# EAGLE design vgnd (EAGLE 6.5.0)
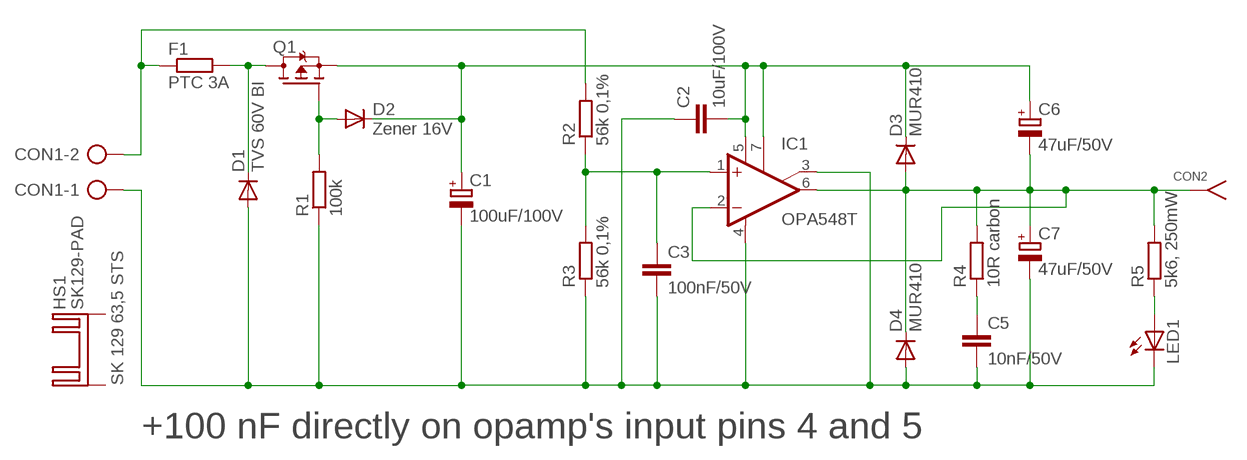
[diagram p0: schematic, sheet 1]

## Parts
C1  100uF/100V  CPOL-EUE5-10.5  [E5-10,5]
C2  10uF/100V  C-EUC2220K  [C2220K]
C3  100nF/50V  C-EUC0603  [C0603]
C5  10nF/50V  C-EUC0603  [C0603]
C6  47uF/50V  CPOL-EUE2.5-7  [E2,5-7]
C7  47uF/50V  CPOL-EUE2.5-7  [E2,5-7]
CON1  AK500/2  [AK500/2]
CON2  FCR7350  [BANANA-PCB-S16N]
D1  TVS 60V BI  DIODE-SMC  [SMC]
D2  Zener 16V  DIODE-SOD323-R  [SOD323-R]
D3  MUR410  DIODE-DO201-15  [DO201-15]
D4  MUR410  DIODE-DO201-15  [DO201-15]
F1  PTC 3A  R-EU_0309/10  [0309/10]
HS1  SK129-PAD  [SK129]
IC1  OPA548T  [TO220-7]
LED1  LEDCHIPLED_0603  [CHIPLED_0603]
Q1  FDD4141TO252  [TO252]
R1  100k  R-EU_R0603  [R0603]
R2  56k 0,1%  R-EU_R0603  [R0603]
R3  56k 0,1%  R-EU_R0603  [R0603]
R4  10R carbon  R-EU_0207/10  [0207/10]
R5  5k6, 250mW  R-EU_M1206  [M1206]

## Nets
GND: C6.- C7.+ CON2.P$1(CON$1) CON2.P$2(CON$1) CON2.P$3(CON$1) CON2.P$4(CON$1) CON2.P$5(CON$1) D3.A D4.C IC1.2(-IN) IC1.6(OUT) R4.2 R5.2
N$1: D1.C F1.2 Q1.3(D)
N$2: C3.1 IC1.1(+IN) R2.1 R3.2
N$3: D2.A Q1.1(G) R1.2
N$4: LED1.A R5.1
N$5: C5.1 R4.1
N$6: CON1.2 F1.1 R2.2
NEG: C1.- C2.1 C3.2 C5.2 C7.- CON1.1 D1.A D4.A IC1.3(ILIM) IC1.4(V-) LED1.C R1.1 R3.1
POS: C1.+ C2.2 C6.+ D2.C D3.C IC1.5(V+) IC1.7(E/S) Q1.2(S)
Unconnected: HS1.A2,5(K) HS1.B2,5(K)

## Notes on the sheet
- +100 nF directly on opamp's input pins 4 and 5

## Library data of the parts
C1 C6 C7 = rcl:CPOL-EU: POLARIZED CAPACITOR, European symbol
C2 C3 C5 = rcl:C-EU: CAPACITOR, European symbol
CON1 = con-ptr500:AK500/2: CONNECTOR; OC_FARNELL: unknown; OC_NEWARK: unknown
CON2 = kaktus:FCR7350: Cliff electronic PCB 4 mm banana socket FCR7350
D1-D4 = diode:DIODE-: DIODE
F1 R5 = rcl:R-EU_: RESISTOR, European symbol
HS1 = heatsink:SK129-PAD: HEATSINK manufacturer Fischer/distributor Buerklin; ITEM: SK 129 63,5 STS
IC1 = burr-brown:OPA548: Operational Amplifier High-Voltage, High-Current; MF: TEXAS INSTRUMENTS; MPN: OPA548T; OC_FARNELL: 1564885; OC_NEWARK: 69K2680
LED1 = adafruit:LED: LED OSRAM: - CHIPLED LG R971, LG N971, LY N971, LG Q971, LY Q971, LO R971, LY R971 LH N974, LH R974 LS Q976, LO Q976, LY Q976 LO Q996 - Hyper CHIPLED LW Q18S LB Q993, LB Q99A, LB R99A - SideLED LS A670, LO A670, LY A670, LG A670, LP A670 LB A673, LV A673, LT A673, LW A673 LH A674 LY A675 LS A676, LA A676, LO A676, LY A676, LW A676 LS A679, LY A679, LG A679 - Hyper Micro SIDELED® LS Y876, LA Y876, LO Y876, LY Y876 LT Y87S - SmartLED LW L88C, LW L88S LB L89C, LB L89S, LG L890 LS L89K, LO L89K, LY L89K LS L896, LA L896, LO L896, LY L896 - TOPLED LS T670, LO T670, LY T670, LG T670, LP T670 LSG T670, LSP T670, LSY T670, LOP T670, LYG T670 LG T671, LOG T671, LSG T671 LB T673, LV T673, LT T673, LW T673 LH T674 LS T676, LA T676, LO T676, LY T676, LB T676, LH T676, LSB T676, LW T676 LB T67C, LV T67C, LT T67C, LS T67K, LO T67K, LY T67K, LW E67C LS E67B, LA E67B, LO E67B, LY E67B, LB E67C, LV E67C, LT E67C LW T67C LS T679, LY T679, LG T679 LS T770, LO T770, LY T770, LG T770, LP T770 LB T773, LV T773, LT T773, LW T773 LH T774 LS E675, LA E675, LY E675, LS T675 LS T776, LA T776, LO T776, LY T776, LB T776 LHGB T686 LT T68C, LB T68C - Hyper Mini TOPLED® LB M676 - Mini TOPLED Santana® LG M470 LS M47K, LO M47K, LY M47K Source: http://www.osram.convergy.de/
Q1 = transistor-fet:FDD4141: P-Channel PowerTrench® MOSFET Source: FDD4141.pdf
R1-R4 = resistor:R-EU_: RESISTOR, European symbol

## Board
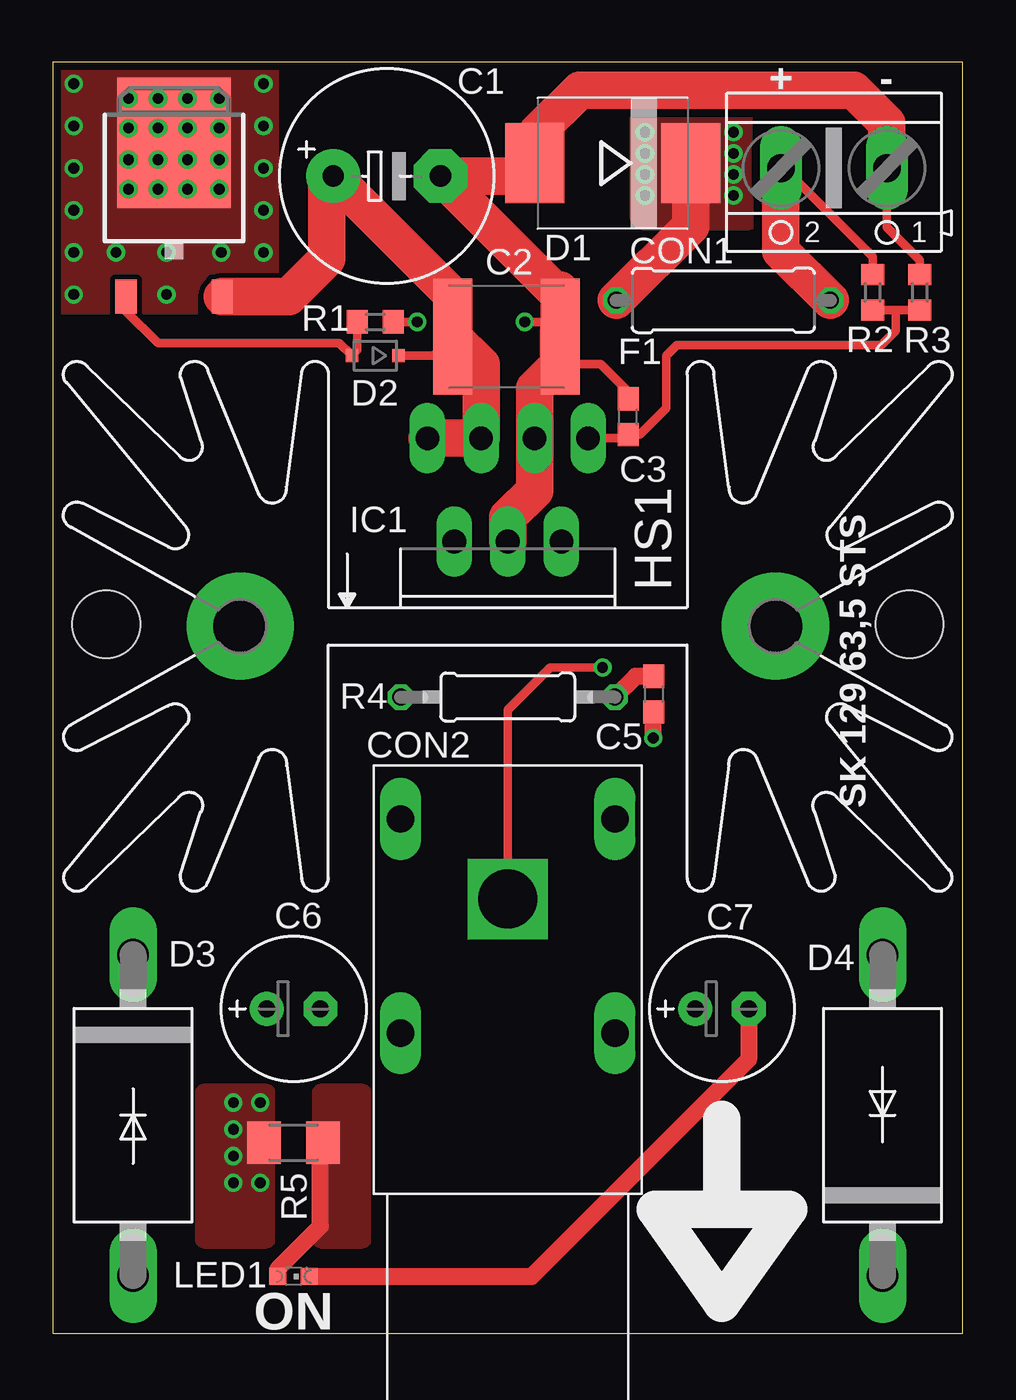
[diagram p1: board, top side]
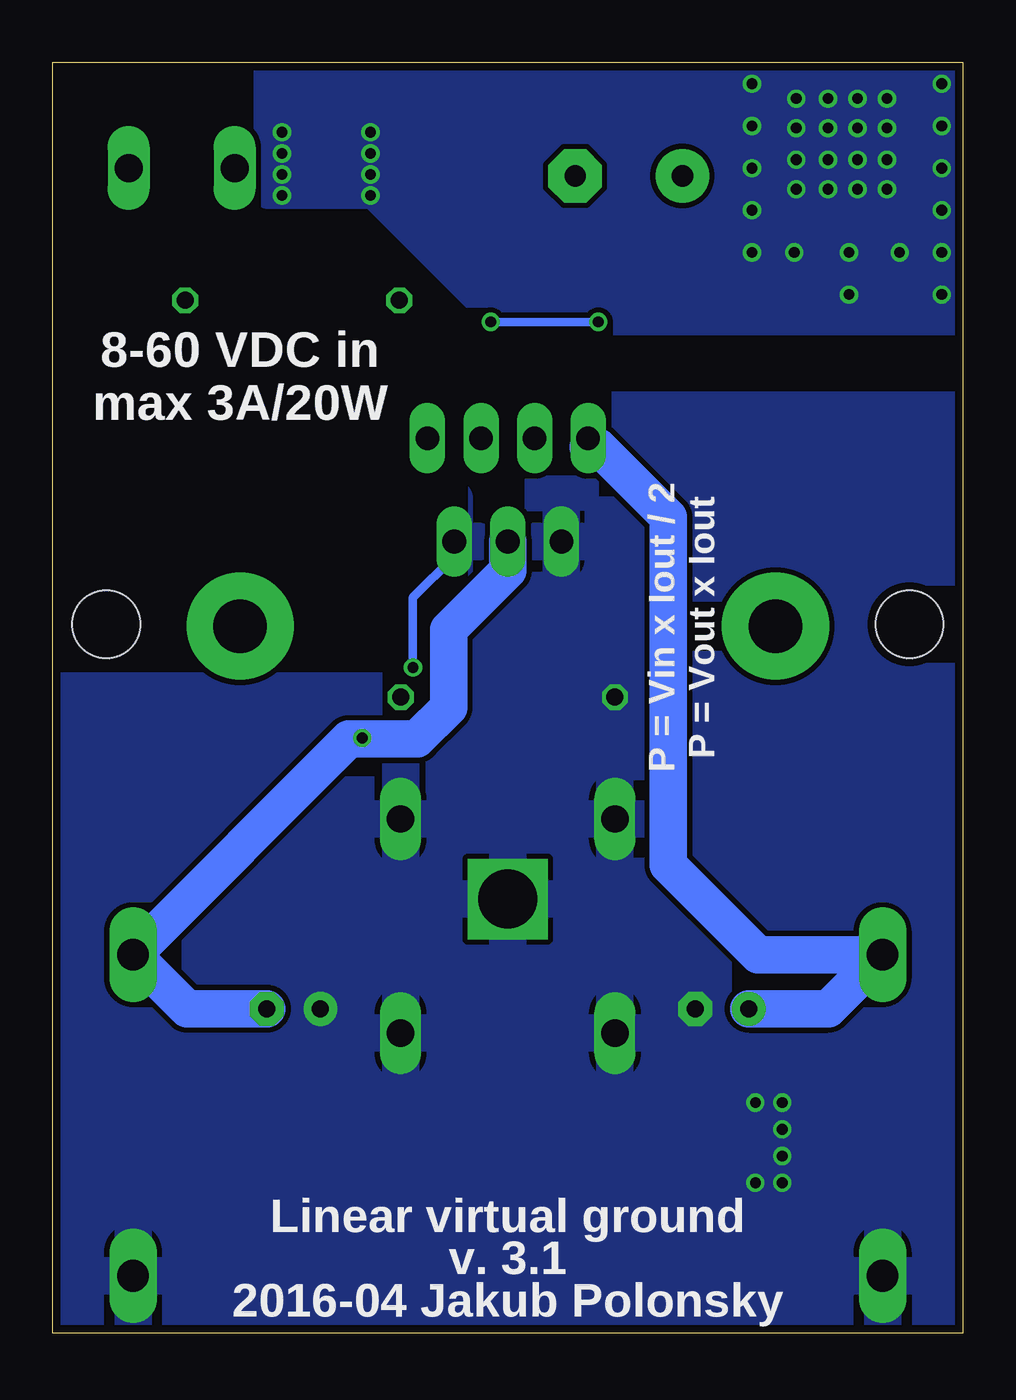
[diagram p2: board, bottom side, seen from below]

Size 43.18 x 60.33 mm. Coordinates in mm from the lower left corner, seen from the top.
Outline: 0,0 43.18,0 43.18,60.33 0,60.33 0,0
Copper layers (1*16): Top 0.0356mm / dielectric 1.5011mm / Bottom 0.0356mm
Design rules "OSHPark - LaenPCBOrder *": minimum track width 6mil, minimum drill 13mil, track to track 6mil, track to pad 6mil, pad to pad 6mil, via to via 6mil, smd to smd 6mil, copper to edge 15mil, drill to drill 6mil, minimum pad ring 7mil, minimum via ring 7mil, stop-mask expansion 3mil, vias tented up to drill 0mil, thermal gap 10mil
Holes 3.2 mm at 2.54,33.66 40.64,33.66

### Footprints (pad centres in the part's own frame; a part is rotated, then mirrored left to right if it is on the bottom)
E5-10,5 = drill 1.016 pad 2.54: + -2.54,0 | drill 1.016 pad 2.54 octagon: - 2.54,0
C2220K = smd 1.85 x 5.5: 1 -2.55,0; 2 2.55,0
C0603 = smd 1.1 x 1: 1 -0.85,0; 2 0.85,0
E2,5-7 = drill 0.813 pad 1.6: + -1.27,0 | drill 0.813 pad 1.6 octagon: - 1.27,0
AK500/2 = drill 1.321 long: 1 -2.515,0; 2 2.515,0
BANANA-PCB-S16N = drill 1.3 long: P$1 -6.35,5.08; P$2 3.81,5.08; P$3 -6.35,-5.08; P$4 3.81,-5.08 | drill 2.8 square: P$5 0.01,0
SMC = smd 2.8 x 3.8: A 3.7,0; C -3.7,0
SOD323-R = smd 0.6 x 0.6: A 1.1,0; C -1.1,0
DO201-15 = drill 1.499 long: A 7.62,0; C -7.62,0
0309/10 = drill 0.813 octagon: 1 -5.08,0; 2 5.08,0
SK129 = drill 2.54 pad 5.08: A2,5 -12.7,-0.889; B2,5 12.7,-0.889
TO220-7 = drill 1.118 pad 1.626 long: 1 -3.81,-8.036; 2 -2.54,-3.126; 3 -1.27,-8.036; 4 0,-3.126; 5 1.27,-8.036; 6 2.54,-3.126; 7 3.81,-8.036
CHIPLED_0603 = smd 0.8 x 0.8: A 0,-0.75; C 0,0.75
TO252 = smd 1 x 1.6: 1 -2.28,-4.8; 2 2.28,-4.8 | smd 5.4 x 6.2: 3 0,2.5
R0603 = smd 1 x 1.1: 1 -0.85,0; 2 0.85,0
0207/10 = drill 0.813 octagon: 1 -5.08,0; 2 5.08,0
M1206 = smd 1.6 x 2: 1 -1.4,0; 2 1.4,0

### Placement (x,y rotation side)
C1  15.85,54.92 0 top
C2  21.54,47.3 180 top
C3  27.3,43.5 90 top
C5  28.51,30.33 270 top
C6  11.43,15.4 0 top
C7  31.75,15.4 0 top
CON1  37.06,55.3 180 top
CON2  21.59,20.6 90 top
D1  26.57,55.53 180 top
D2  15.3,46.4 180 top
D3  3.81,10.35 270 top
D4  39.37,10.35 90 top
F1  31.82,49.02 180 top
HS1  21.59,34.45 0 top
IC1  21.59,34.45 180 top
LED1  11.43,2.7 270 top
Q1  5.76,54 0 top
R1  15.3,48 180 top
R2  38.9,49.4 90 top
R3  41.13,49.4 270 top
R4  21.59,30.19 180 top
R5  11.43,9.05 180 top

### Tracks (layer width: path | path; a pad name or v marks a point on that pad's centre or on a via)
GND  (via drill 0.51)
  Top 0.406: CON2.P$5 21.59,29.59 23.6,31.6 v26.09,31.6
  Bottom 0.406: IC1.2 24.13,36.87 26.09,34.91 v26.09,31.6
  other vias: 9.84,10.95 9.84,7.14 8.57,7.14 8.57,8.41 8.57,10.95 8.57,9.68
  pour Top (isolate 0.254, no thermals): 7.14,11.43 7.14,4.45 10.16,4.45 10.16,11.43
  pour Bottom (isolate 0.254): 0,0 0,43.81 22.59,43.81 22.59,30.48 43.18,30.48 43.18,0
N$1  (via drill 0.51)
  Top 1.778: D1.C 30.27,52.55 F1.2
  other vias: 28.1,57 28.1,56 28.1,55 28.1,54 32.3,57 32.3,56 32.3,55 32.3,54 3.6,58.6 7.9,58.6 5,58.6 6.4,58.6 3.6,57.2 7.9,57.2 5,57.2 6.4,57.2 3.6,55.7 7.9,55.7 5,55.7 6.4,55.7 3.6,54.3 7.9,54.3 5,54.3 6.4,54.3 1,59.3 1,57.3 1,55.3 1,53.3 1,51.3 1,49.3 10,59.3 10,57.3 10,55.3 10,53.3 10,51.3 8,51.3 3,51.3 5.4,51.3 5.4,49.3
  pour Top (isolate 0.254, no thermals): 0,60 0,49 10.1,49 10.1,60
  pour Bottom (isolate 0.254): 0,60 0,48 22,48 28,54 33,54 33,60
  pour Top (isolate 0.406, no thermals): 28,57 28,53 33,53 33,58 28,58
N$2
  Top 0.406: IC1.1 27.14,42.48 C3.1 27.85,42.65 29.1,43.9 29.1,46.4 29.6,46.9 39.32,46.9 40.01,47.59 40.01,48.55 | R2.1 40.01,48.55 | 40.01,48.55 R3.2
N$3
  Top 0.406: Q1.1 3.48,48.52 5,47 13.6,47 D2.A 14.45,46.65 R1.2
N$4
  Top 0.813: LED1.A 10.68,3.06 12.7,5.08 12.7,9.18 | 12.7,9.53 12.7,9.18 | 12.7,9.18 R5.1
  pour Top (isolate 0.254, no thermals): 12.7,11.43 12.7,4.45 14.72,4.45 14.72,11.43
N$5
  Top 0.813: C5.1 27.66,31.18 R4.1
N$6
  Top 0.406: R2.2 38.9,51.1 34.7,55.3 CON1.2
  Top 1.778: CON1.2 34.55,51.37 F1.1
NEG  (via drill 0.51)
  Top 0.406: R1.1 v17.3,48 | v22.4,48 24.09,48 | C3.2 27.3,44.7 26,46 24,46 | CON1.1 39.58,52.49 41.13,50.94 R3.1
  Top 0.813: C7.- 33.02,13 22.72,2.7 LED1.C | v28.49,28.25 28.49,29.46 C5.2
  Top 1.778: IC1.4 21.59,38.73 22.86,40.01 IC1.3 22.86,44.86 24,46 24,47.91 24.09,48 | CON1.1 39.58,57.42 38,59 25,59 23,57 23,55.66 D1.A 22.26,54.92 C1.- 23.8,49.52 24.09,49.52 24.09,48 | C2.1 24.09,48
  Bottom 0.406: v17.3,48 v22.4,48
  Bottom 0.813: 29.14,28.2 28.54,28.2 v28.49,28.25
  Bottom 1.778: C7.- 36.8,15.4 D4.A 29.14,28.2 25.9,28.2 24.4,29.7 24.4,33.4 21.59,36.21 IC1.4
POS
  Top 0.406: D2.C 18.08,46.4 C2.2
  Top 1.778: IC1.5 20.32,43 | 20.32,43 20.32,45.97 C2.2 18.98,49.25 C1.+ 13,54.61 13,51 11.2,49.2 Q1.2 | IC1.7 19.8,42.48 20.32,43
  Bottom 1.27: IC1.7 17.78,42.07
  Bottom 1.778: C6.+ 6.38,15.4 D3.C 9.72,17.97 13.97,22.23 13.97,38.73 17.3,42.07 17.78,42.07

### Text on the board
tPlace: + | - | SK 129 63,5 STS | ON
bPlace: 8-60 VDC in / max 3A/20W | P = Vin x Iout / 2 / P = Vout x Iout | Linear virtual ground / v. 3.1 / 2016-04 Jakub Polonsky